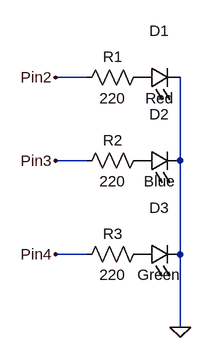
[diagram p0: schematic ColorMixer.asc]
ColorMixer.asc, the LTspice schematic file:
Version 4
SHEET 1 880 680
WIRE 80 32 32 32
WIRE 80 160 32 160
WIRE 224 160 224 32
WIRE 80 304 32 304
WIRE 224 304 224 160
WIRE 224 416 224 304
FLAG 32 32 Pin2
FLAG 32 160 Pin3
FLAG 32 304 Pin4
FLAG 224 416 0
SYMBOL res 176 16 R90
WINDOW 0 0 56 VBottom 2
WINDOW 3 32 56 VTop 2
SYMATTR InstName R1
SYMATTR Value 220
SYMBOL res 176 144 R90
WINDOW 0 0 56 VBottom 2
WINDOW 3 32 56 VTop 2
SYMATTR InstName R2
SYMATTR Value 220
SYMBOL res 176 288 R90
WINDOW 0 0 56 VBottom 2
WINDOW 3 32 56 VTop 2
SYMATTR InstName R3
SYMATTR Value 220
SYMBOL LED 160 48 R270
WINDOW 0 72 32 VTop 2
WINDOW 3 0 32 VBottom 2
SYMATTR InstName D1
SYMATTR Value Red
SYMBOL LED 160 176 R270
WINDOW 0 72 32 VTop 2
WINDOW 3 0 32 VBottom 2
SYMATTR InstName D2
SYMATTR Value Blue
SYMBOL LED 160 320 R270
WINDOW 0 72 32 VTop 2
WINDOW 3 0 32 VBottom 2
SYMATTR InstName D3
SYMATTR Value Green

The netlist it stands for:
* ColorMixer.asc
R1 P001 Pin2 220
R2 P002 Pin3 220
R3 P003 Pin4 220
D1 P001 0 Red
D2 P002 0 Blue
D3 P003 0 Green
.model D D
.lib standard.dio
.backanno
.end